# Altium schematic sheet MONITOR.SchDoc
size A4; SheetNumber: 8; SheetTotal: 8
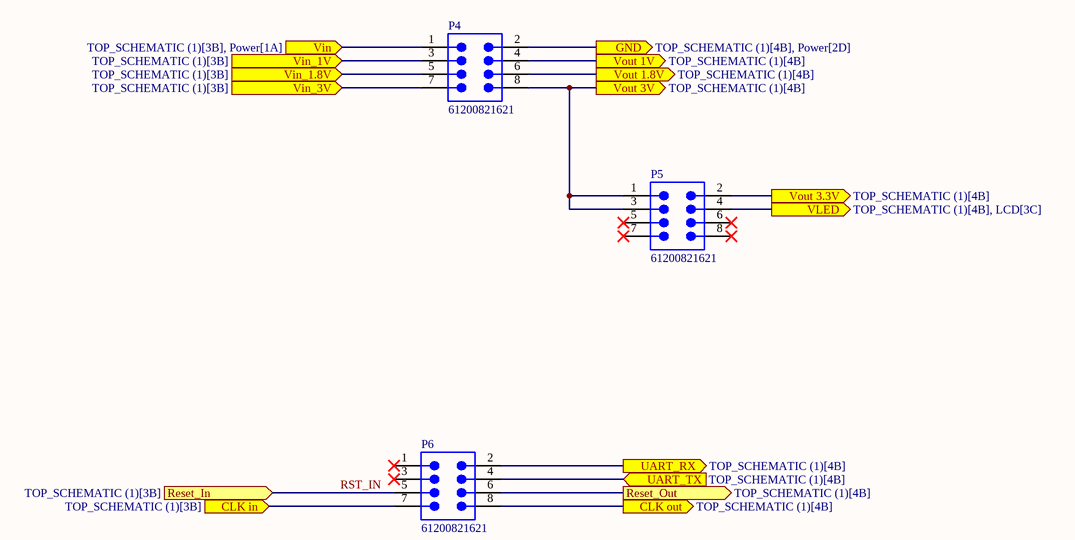
[diagram p0: MONITOR.SchDoc]

## Parts
P4  61200821621  [61200821621]
P5  61200821621  [61200821621]
P6  61200821621  [61200821621]

## Ports
CLK in (in, see TOP_SCHEMATIC (1)[3B]), CLK out (out, see TOP_SCHEMATIC (1)[4B]), GND (out, see TOP_SCHEMATIC (1)[4B], Power[2D]), Reset_In (in, see TOP_SCHEMATIC (1)[3B]), Reset_Out (out, see TOP_SCHEMATIC (1)[4B]), UART_RX (out, see TOP_SCHEMATIC (1)[4B]), UART_TX (in, see TOP_SCHEMATIC (1)[4B]), Vin (in, see TOP_SCHEMATIC (1)[3B], Power[1A]), Vin_1.8V (in, see TOP_SCHEMATIC (1)[3B]), Vin_1V (in, see TOP_SCHEMATIC (1)[3B]), Vin_3V (in, see TOP_SCHEMATIC (1)[3B]), VLED (out, see TOP_SCHEMATIC (1)[4B], LCD[3C]), Vout 1.8V (out, see TOP_SCHEMATIC (1)[4B]), Vout 1V (out, see TOP_SCHEMATIC (1)[4B]), Vout 3.3V (out, see TOP_SCHEMATIC (1)[4B]), Vout 3V (out, see TOP_SCHEMATIC (1)[4B])

## Nets
CLK in: P6.7 ; port CLK in
CLK out: P6.8 ; port CLK out
GND: P4.2 ; port GND
Reset_Out: P6.6 ; port Reset_Out
RST_IN: P6.5 ; port Reset_In
UART_RX: P6.2 ; port UART_RX
UART_TX: P6.4 ; port UART_TX
Vin: P4.1 ; port Vin
Vin_1.8V: P4.5 ; port Vin_1.8V
Vin_1V: P4.3 ; port Vin_1V
Vin_3V: P4.7 ; port Vin_3V
VLED: P5.4 ; port VLED
Vout 1.8V: P4.6 ; port Vout 1.8V
Vout 1V: P4.4 ; port Vout 1V
Vout 3.3V: P5.2 ; port Vout 3.3V
Vout 3V: P4.8 P5.1 P5.3 ; port Vout 3V

Not connected (* = marked no-connect by the designer): P5 5* 6* 7* 8*; P6 1* 3*

## Library data of the parts
P4-P6 = CMP-1502-00006-3: Wr-bhd; 2.54MM Pitch 8 Way 2 Row Shrouded Straight Pcb Header, Surface Mount; Number of Contacts: 8; Operating Supply Voltage: 250V; Gender: Male; Current Rating: 3A; Contact Resistance: 20mΩ; Connector Type: Male Pin; Insulation Resistance: 1GΩ; Pitch: 2.54mm; RoHS: Compliant; Row Spacing: 2.54mm; Color: Black; Termination: Solder; Min Operating Temperature: -40°C; Number of Rows: 2; Number of Positions: 8; Contact Material: Copper; Orientation: Vertical; Number of Pins: 8; Contact Plating: Gold; Insulation Material: PBT; Lead Pitch: 2.54mm; Length: 17.82mm; Max Operating Temperature: 105°C; Mount: Through Hole